# Altium schematic sheet DDR3_LoongSon.SchDoc
size A1
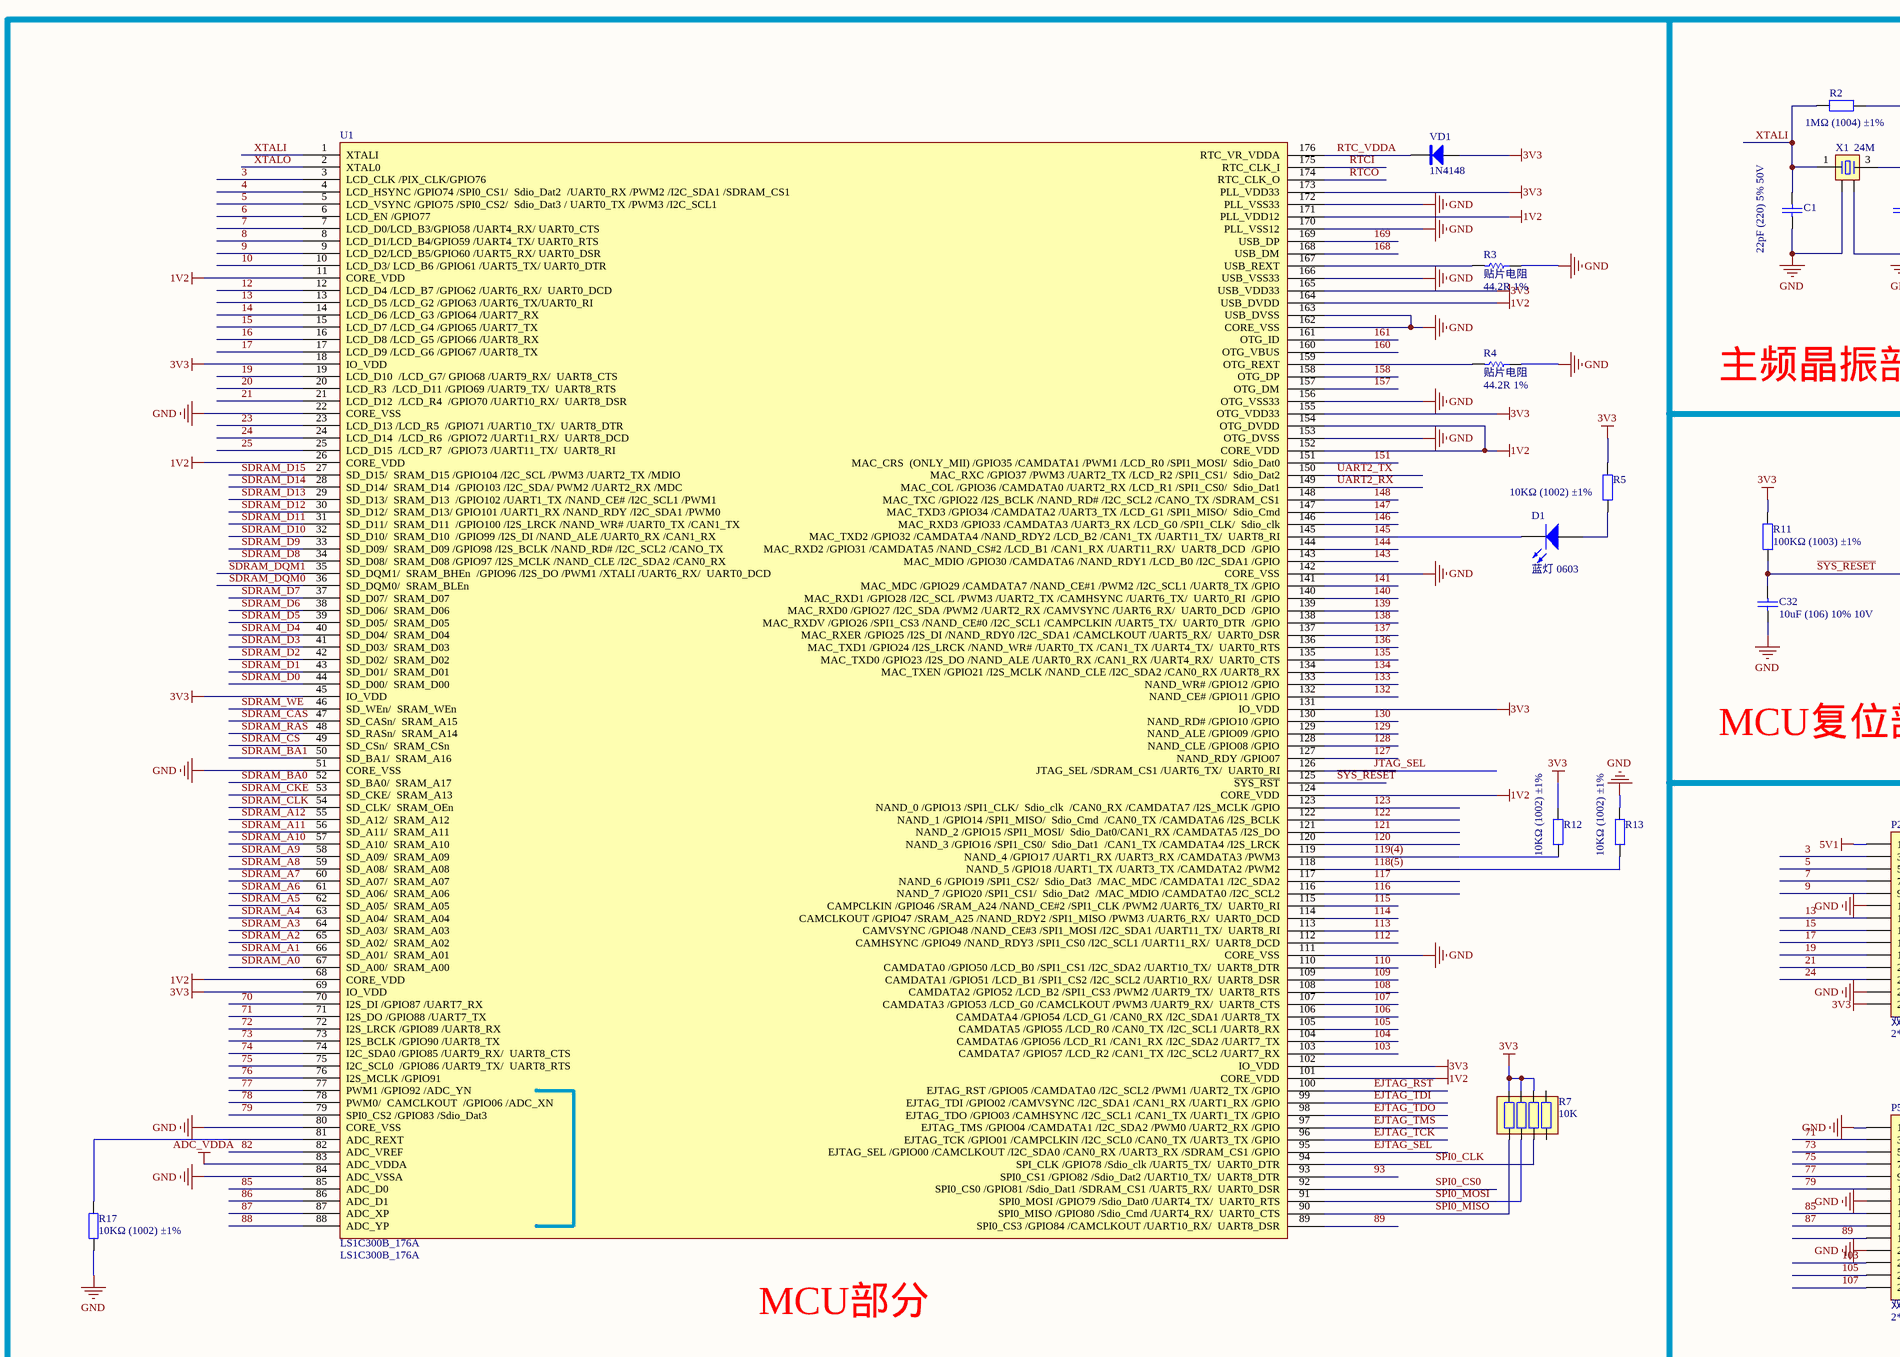
[diagram p0: DDR3_LoongSon.SchDoc, top left]
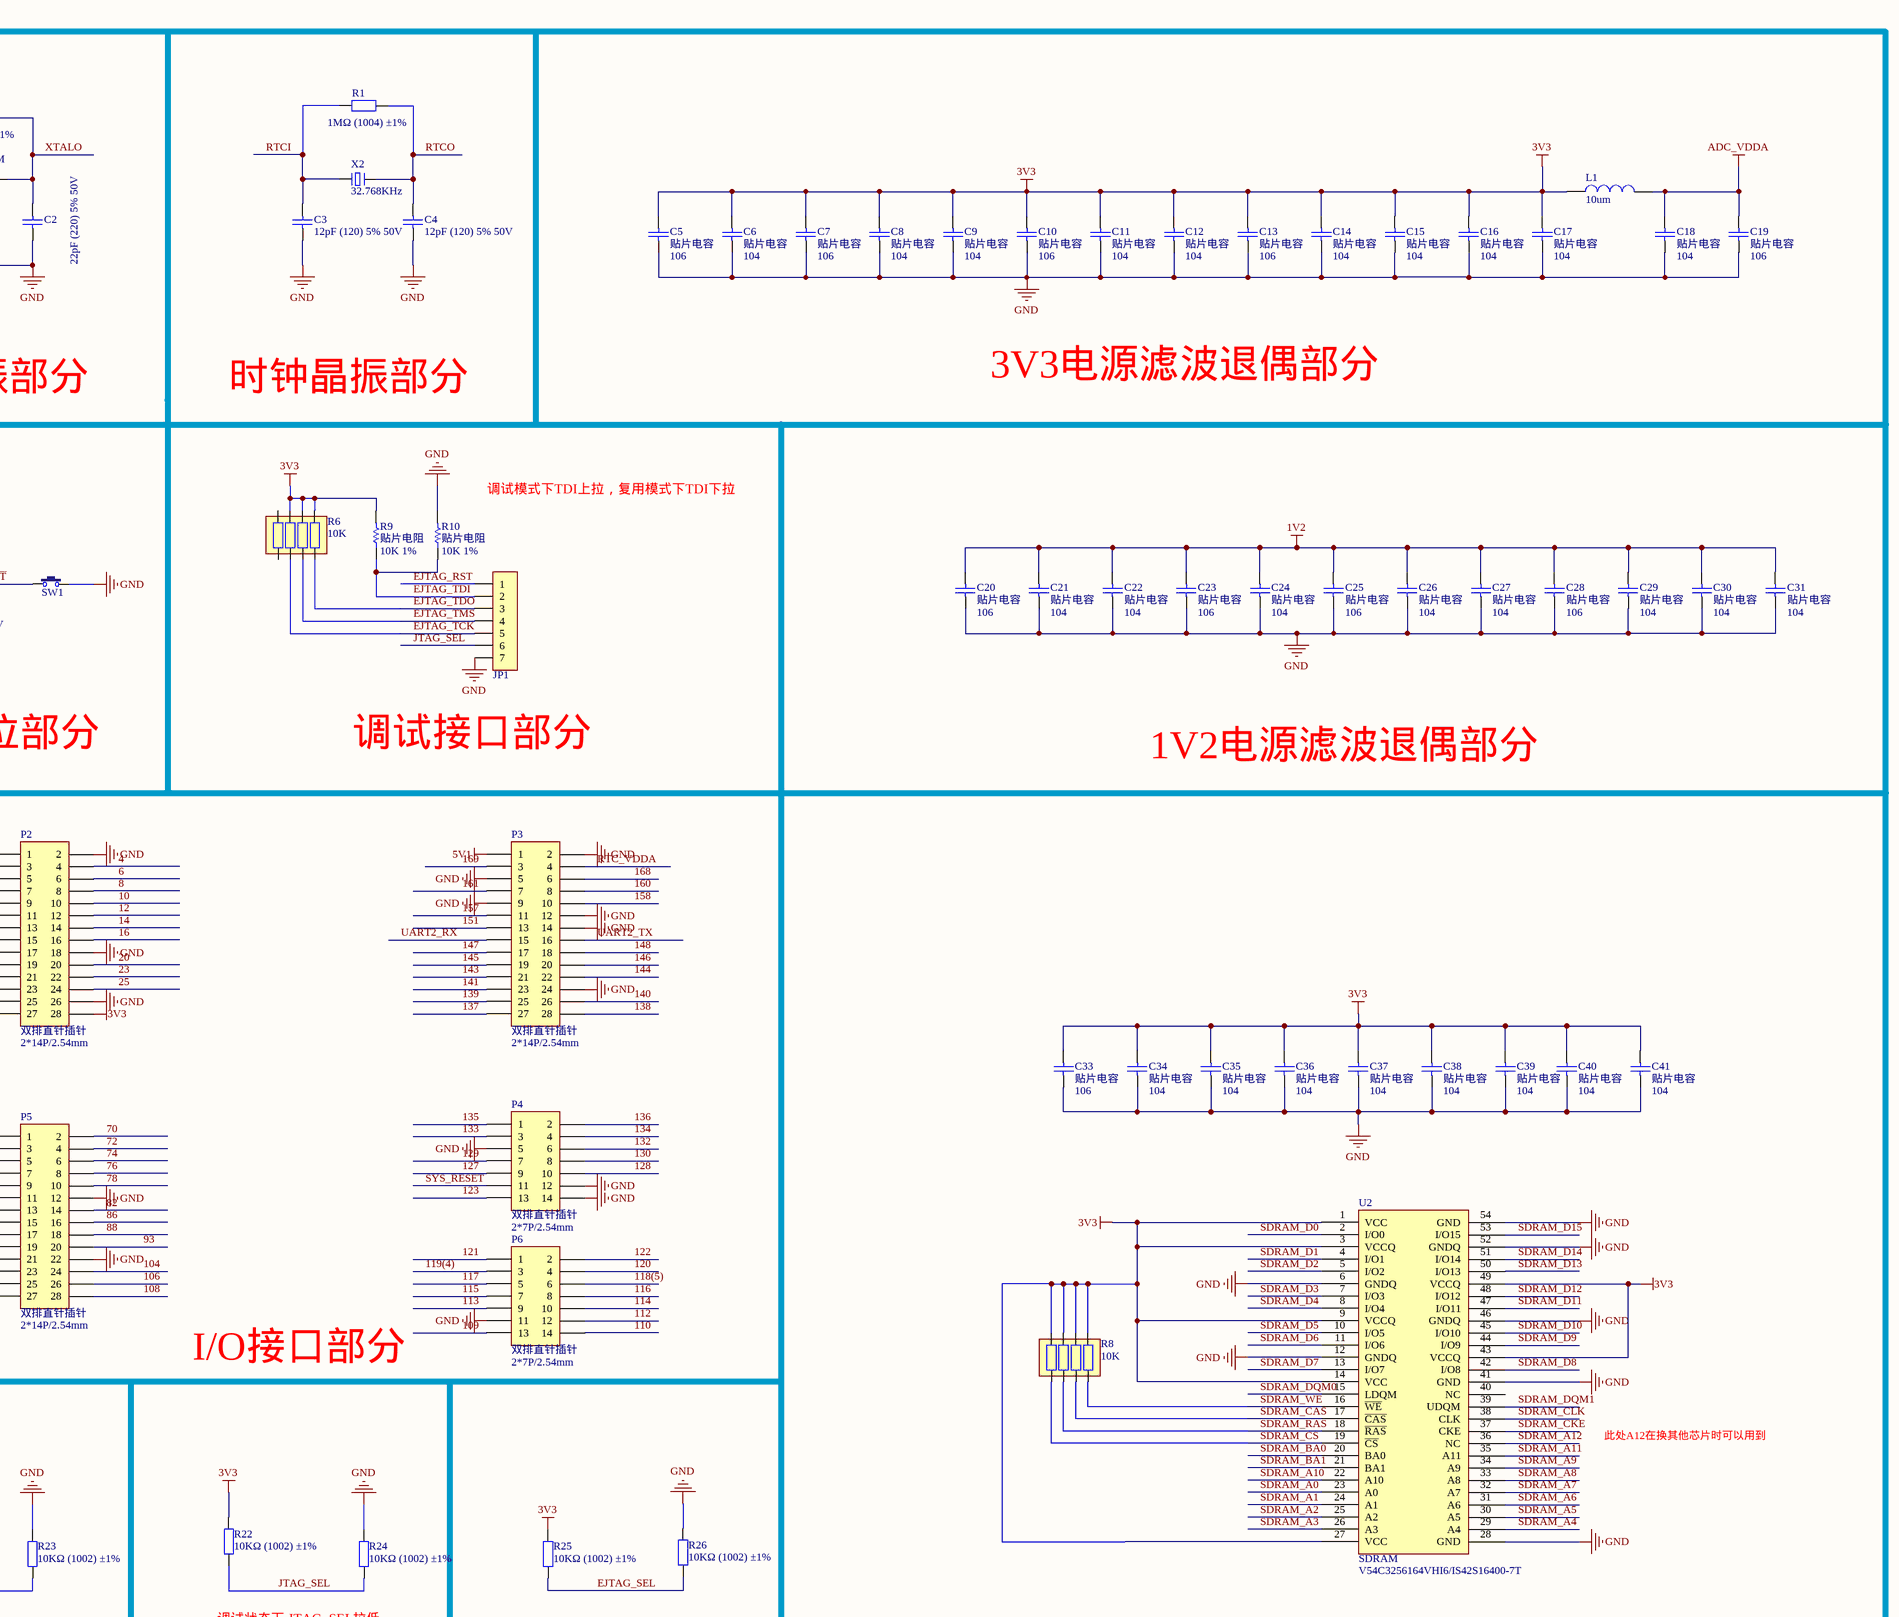
[diagram p1: DDR3_LoongSon.SchDoc, top right]
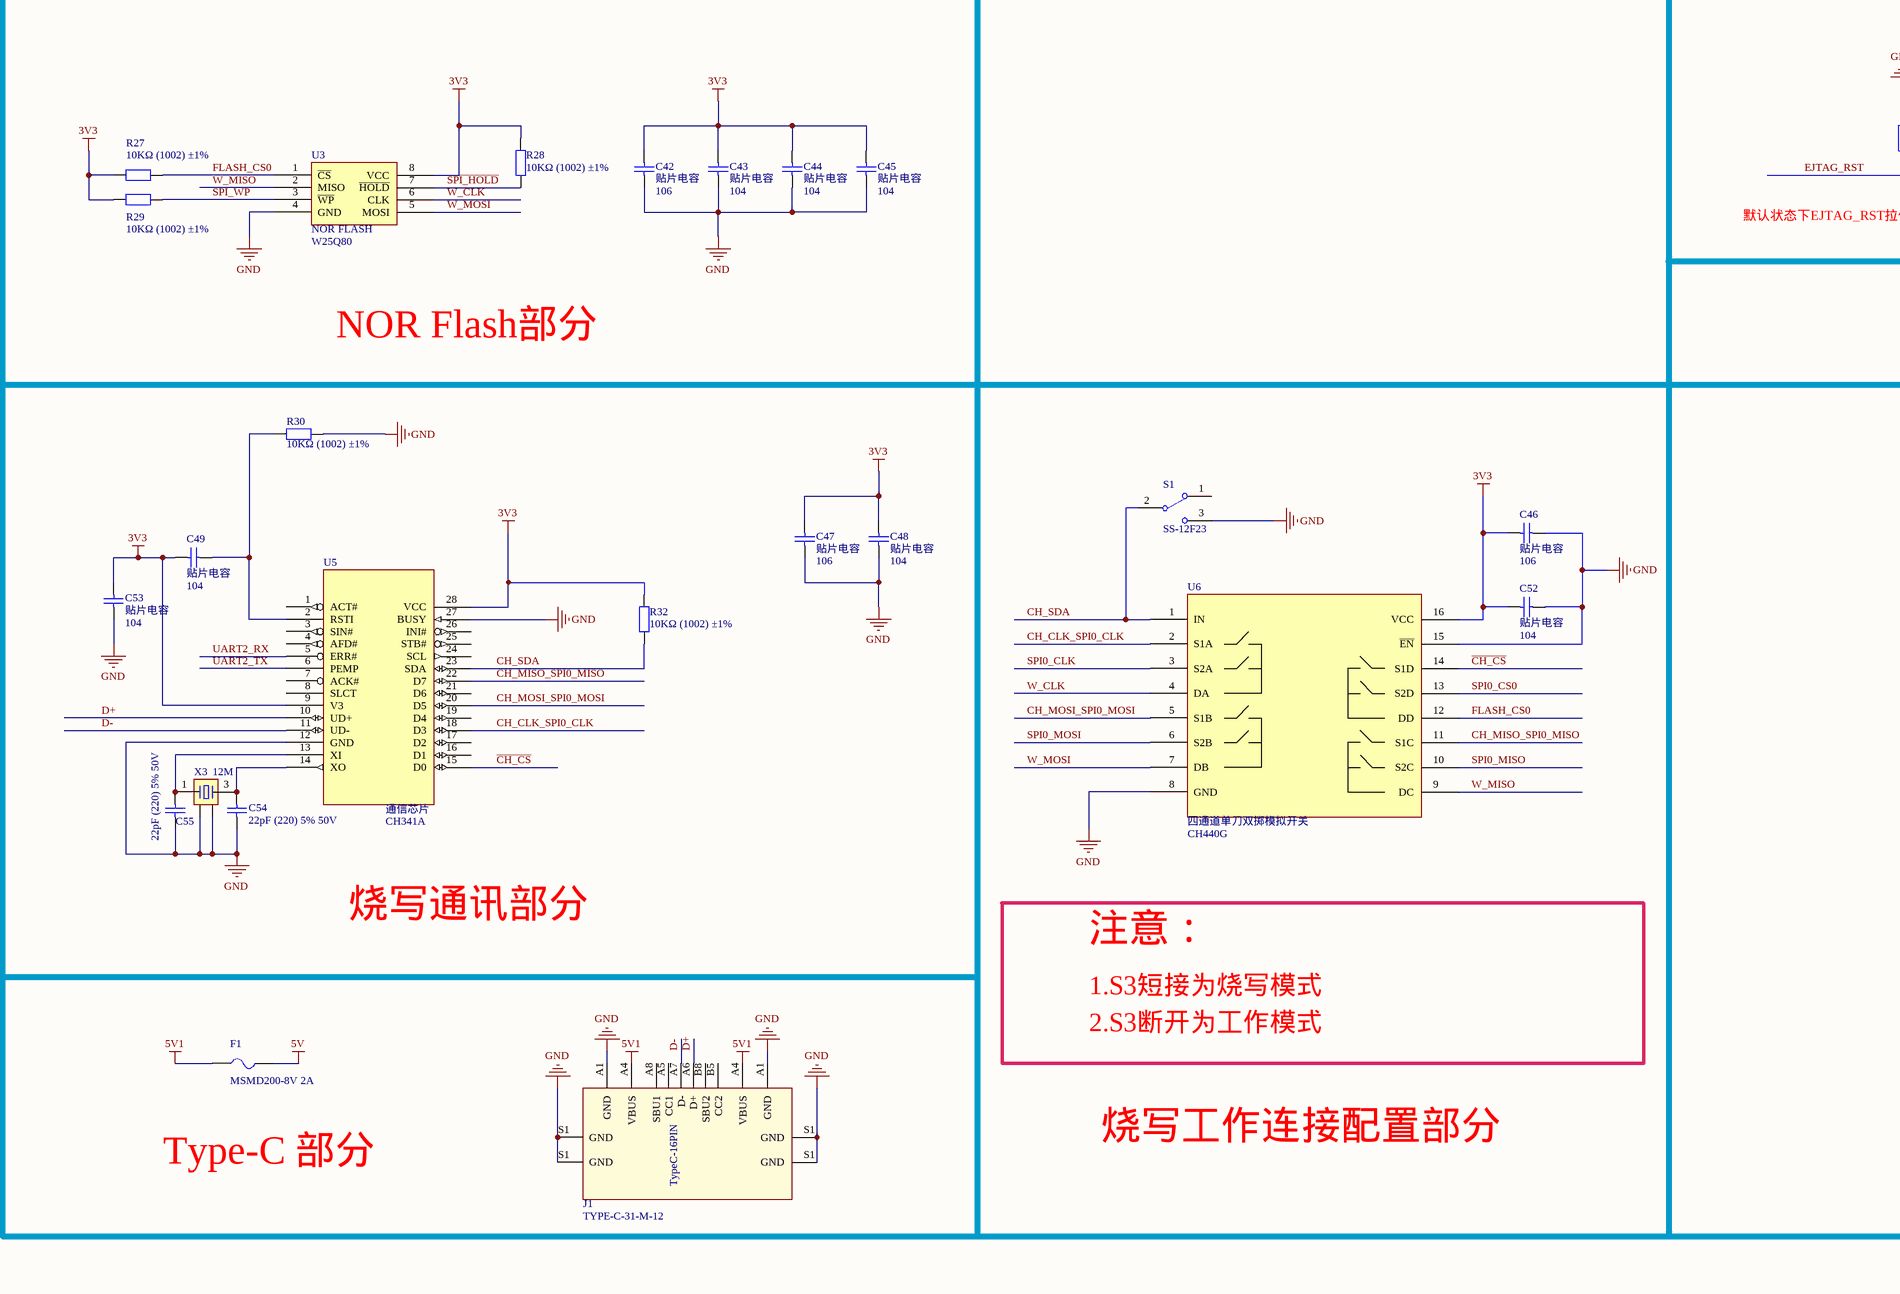
[diagram p2: DDR3_LoongSon.SchDoc, bottom left]
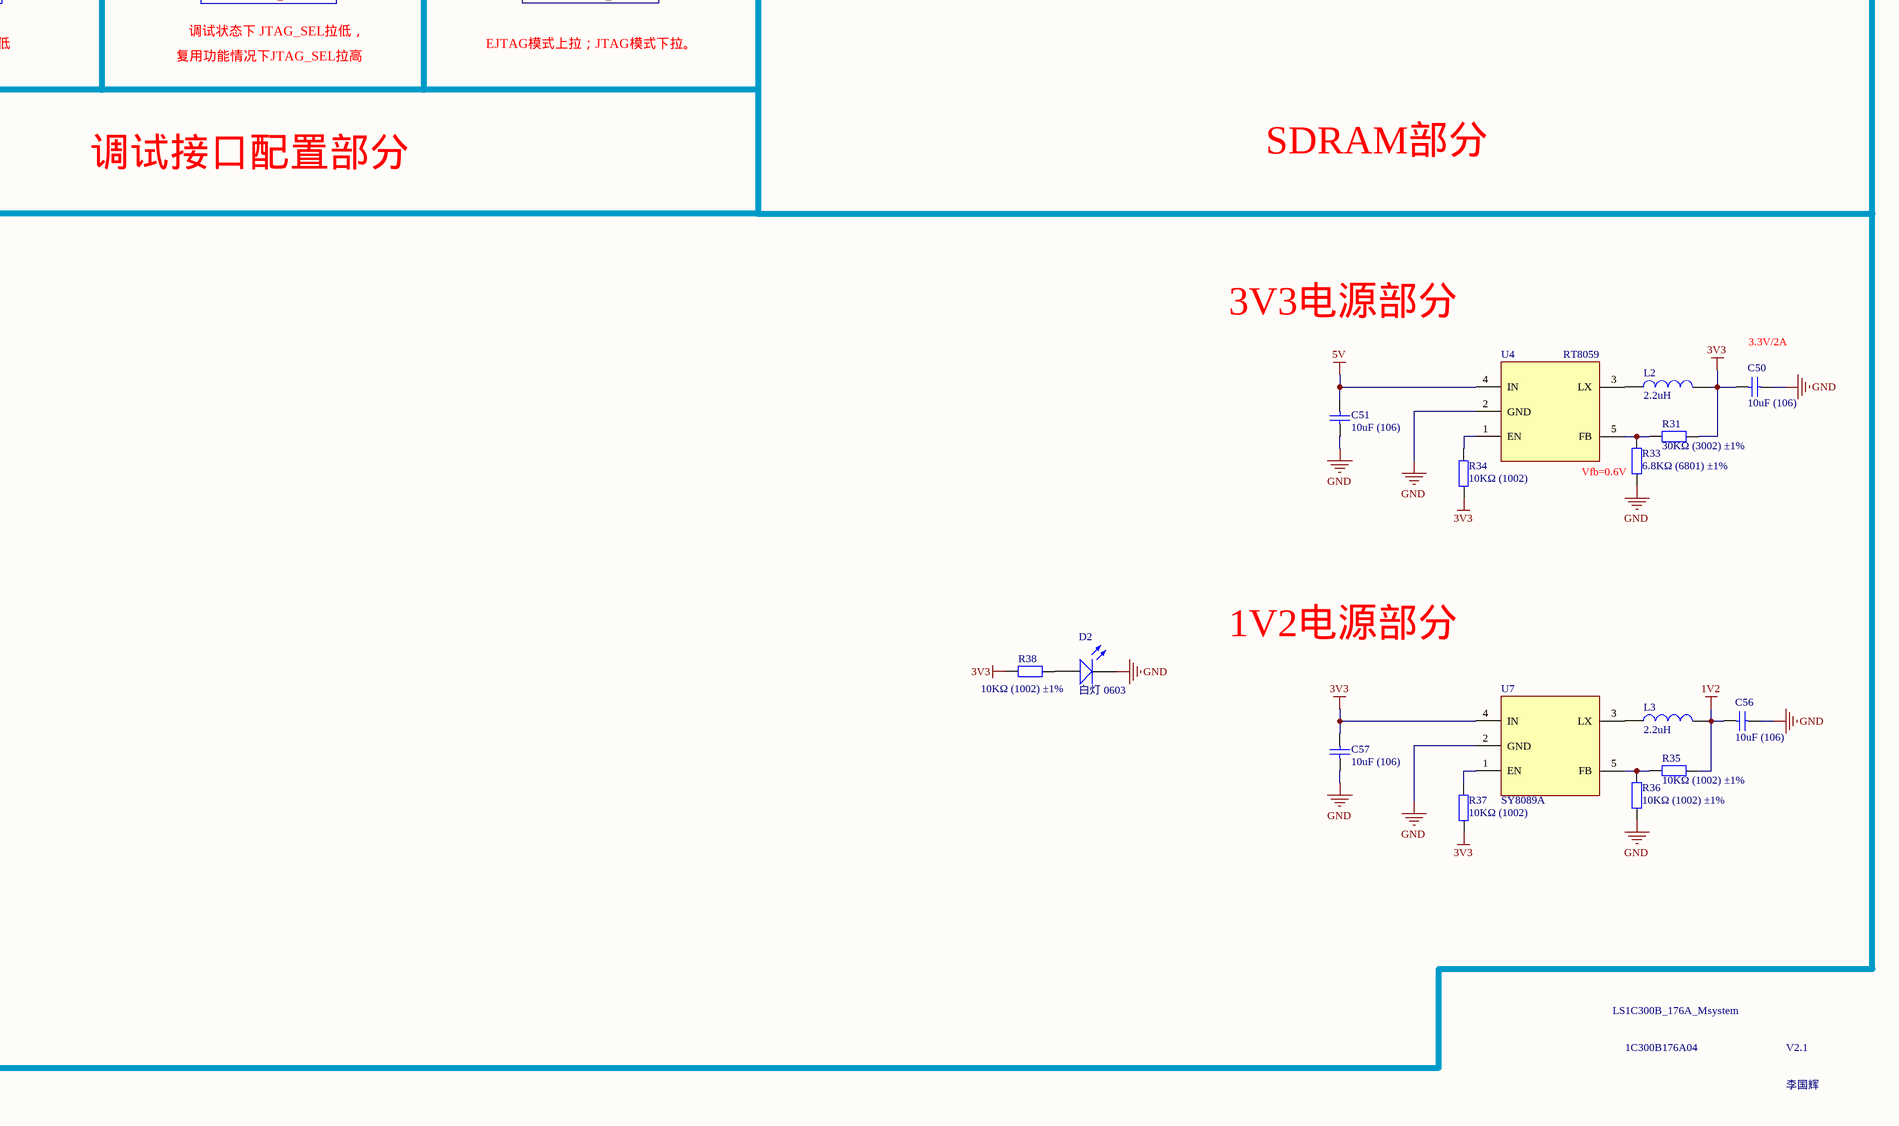
[diagram p3: DDR3_LoongSon.SchDoc, bottom right]

## Parts
C1  22pF (220) 5% 50V  [LC-0603_C]
C2  22pF (220) 5% 50V  [LC-0603_C]
C3  12pF (120) 5% 50V  [LC-0603_C]
C4  12pF (120) 5% 50V  [LC-0603_C]
C5  贴片电容  value 106  [LC-0603_C]
C6  贴片电容  value 104  [LC-0603_C]
C7  贴片电容  value 106  [LC-0603_C]
C8  贴片电容  value 104  [LC-0603_C]
C9  贴片电容  value 104  [LC-0603_C]
C10  贴片电容  value 106  [LC-0603_C]
C11  贴片电容  value 104  [LC-0603_C]
C12  贴片电容  value 104  [LC-0603_C]
C13  贴片电容  value 106  [LC-0603_C]
C14  贴片电容  value 104  [LC-0603_C]
C15  贴片电容  value 104  [LC-0603_C]
C16  贴片电容  value 104  [LC-0603_C]
C17  贴片电容  value 104  [LC-0603_C]
C18  贴片电容  value 104  [LC-0603_C]
C19  贴片电容  value 106  [LC-0603_C]
C20  贴片电容  value 106  [LC-0603_C]
C21  贴片电容  value 104  [LC-0603_C]
C22  贴片电容  value 104  [LC-0603_C]
C23  贴片电容  value 106  [LC-0603_C]
C24  贴片电容  value 104  [LC-0603_C]
C25  贴片电容  value 106  [LC-0603_C]
C26  贴片电容  value 104  [LC-0603_C]
C27  贴片电容  value 104  [LC-0603_C]
C28  贴片电容  value 106  [LC-0603_C]
C29  贴片电容  value 104  [LC-0603_C]
C30  贴片电容  value 104  [LC-0603_C]
C31  贴片电容  value 104  [LC-0603_C]
C32  10uF (106) 10% 10V  [LC-0603_C]
C33  贴片电容  value 106  [LC-0603_C]
C34  贴片电容  value 104  [LC-0603_C]
C35  贴片电容  value 104  [LC-0603_C]
C36  贴片电容  value 104  [LC-0603_C]
C37  贴片电容  value 104  [LC-0603_C]
C38  贴片电容  value 104  [LC-0603_C]
C39  贴片电容  value 104  [LC-0603_C]
C40  贴片电容  value 104  [LC-0603_C]
C41  贴片电容  value 104  [LC-0603_C]
C42  贴片电容  value 106  [LC-0603_C]
C43  贴片电容  value 104  [LC-0603_C]
C44  贴片电容  value 104  [LC-0603_C]
C45  贴片电容  value 104  [LC-0603_C]
C46  贴片电容  value 106  [LC-0603_C]
C47  贴片电容  value 106  [LC-0603_C]
C48  贴片电容  value 104  [LC-0603_C]
C49  贴片电容  value 104  [LC-0603_C]
C50  10uF (106)  [LC-0603_C]
C51  10uF (106)  [LC-0603_C]
C52  贴片电容  value 104  [LC-0603_C]
C53  贴片电容  value 104  [LC-0603_C]
C54  22pF (220) 5% 50V  [LC-0603_C]
C55  22pF (220) 5% 50V  [LC-0603_C]
C56  10uF (106)  [LC-0603_C]
C57  10uF (106)  [LC-0603_C]
D1  蓝灯 0603  [LC-0603_LED_S1]
D2  白灯 0603  [LC-0603_LED_S1]
F1  MSMD200-8V 2A  [FU 1206]
J1  TYPE-C-31-M-12  [TYPE-C-31-M-12]
JP1  HDR-1X7  [HDR-1X7]  (value not drawn)
L1  10um  [L 0603]
L2  2.2uH  [2520-L]
L3  2.2uH  [2520-L]
P2  双排直针插针  value 2*14P/2.54mm  [HDR2X14]
P3  双排直针插针  value 2*14P/2.54mm  [HDR2X14]
P4  双排直针插针  value 2*7P/2.54mm  [HDR2X7]
P5  双排直针插针  value 2*14P/2.54mm  [HDR2X14]
P6  双排直针插针  value 2*7P/2.54mm  [HDR2X7]
R1  1MΩ (1004) ±1%  [LC-0603_R]
R2  1MΩ (1004) ±1%  [LC-0603_R]
R3  贴片电阻  value 44.2R 1%  [LC-0603_R]
R4  贴片电阻  value 44.2R 1%  [LC-0603_R]
R5  10KΩ (1002) ±1%  [LC-0603_R]
R6  10K  [RCA-8P4R-0603]
R7  10K  [RCA-8P4R-0603]
R8  10K  [RCA-8P4R-0603]
R9  贴片电阻  value 10K 1%  [LC-0603_R]
R10  贴片电阻  value 10K 1%  [LC-0603_R]
R11  100KΩ (1003) ±1%  [LC-0603_R]
R12  10KΩ (1002) ±1%  [LC-0603_R]
R13  10KΩ (1002) ±1%  [LC-0603_R]
R17  10KΩ (1002) ±1%  [LC-0603_R]
R22  10KΩ (1002) ±1%  [LC-0603_R]
R23  10KΩ (1002) ±1%  [LC-0603_R]
R24  10KΩ (1002) ±1%  [LC-0603_R]
R25  10KΩ (1002) ±1%  [LC-0603_R]
R26  10KΩ (1002) ±1%  [LC-0603_R]
R27  10KΩ (1002) ±1%  [LC-0603_R]
R28  10KΩ (1002) ±1%  [LC-0603_R]
R29  10KΩ (1002) ±1%  [LC-0603_R]
R30  10KΩ (1002) ±1%  [LC-0603_R]
R31  30KΩ (3002) ±1%  [LC-0603_R]
R32  10KΩ (1002) ±1%  [LC-0603_R]
R33  6.8KΩ (6801) ±1%  [LC-0603_R]
R34  10KΩ (1002)  [LC-0603_R]
R35  10KΩ (1002) ±1%  [LC-0603_R]
R36  10KΩ (1002) ±1%  [LC-0603_R]
R37  10KΩ (1002)  [LC-0603_R]
R38  10KΩ (1002) ±1%  [LC-0603_R]
S1  SS-12F23  [MSK-12C01-07]
SW1  3x6x5  [TSW SMD-3*6*2.5]  (value not drawn)
U1  LS1C300B_176A  [QFP176]
U2  SDRAM  value V54C3256164VHI6/IS42S16400-7T  [TSOP54]
U3  NOR FLASH  value W25Q80  [SOIC-8-N]
U4  RT8059  [SOT23-5N]
U5  通信芯片  value CH341A  [SOP28]
U6  四通道单刀双掷模拟开关  value CH440G  [SOP-16]
U7  SY8089A  [SOT23-5N]
VD1  1N4148  [MINI_MELF (LL34)]
X1  24M  [XTAL-3225]
X2  32.768KHz  [XTAL-3215]
X3  12M  [XTAL-3225]

## Nets
1V2: C20.2 C21.2 C22.2 C23.2 C24.2 C25.2 C26.2 C27.2 C28.2 C29.2 C30.2 C31.2 C56.1 L3.2 R35.2 U1.11(CORE_VDD) U1.26(CORE_VDD) U1.68(CORE_VDD) U1.101(CORE_VDD) U1.124(CORE_VDD) U1.152(CORE_VDD) U1.154(OTG_DVDD) U1.164(USB_DVDD) U1.171(PLL_VDD12)
3V3: C5.2 C6.2 C7.2 C8.2 C9.2 C10.2 C11.2 C12.2 C13.2 C14.2 C15.2 C16.2 C17.2 C33.2 C34.2 C35.2 C36.2 C37.2 C38.2 C39.2 C40.2 C41.2 C42.2 C43.2 C44.2 C45.2 C46.2 C47.2 C48.2 C49.2 C50.1 C52.2 C53.2 C57.2 L1.1 L2.2 P2.27 P2.28 R5.2 R6.5 R6.6 R6.7 R7.6 R7.7 R7.8 R8.5 R8.6 R8.7 R8.8 R9.2 R11.2 R12.2 R22.2 R25.2 R27.1 R28.2 R29.1 R31.2 R32.2 R34.1 R37.1 R38.1 U1.18(IO_VDD) U1.45(IO_VDD) U1.69(IO_VDD) U1.102(IO_VDD) U1.131(IO_VDD) U1.155(OTG_VDD33) U1.165(USB_VDD33) U1.173(PLL_VDD33) U2.1(VCC) U2.3(VCCQ) U2.9(VCCQ) U2.14(VCC) U2.27(VCC) U2.43(VCCQ) U2.49(VCCQ) U3.8(VCC) U5.9(V3) U5.28(VCC) U6.16(VCC) U7.4(IN) VD1.1(A)
5V: C51.2 F1.2 U4.4(IN)
5V1: F1.1 J1.A4(VBUS) P2.1 P3.1
ADC_VDDA: C18.2 C19.2 L1.2 U1.83(ADC_VDDA)
GND: C1.1 C2.1 C3.1 C4.1 C5.1 C6.1 C7.1 C8.1 C9.1 C10.1 C11.1 C12.1 C13.1 C14.1 C15.1 C16.1 C17.1 C18.1 C19.1 C20.1 C21.1 C22.1 C23.1 C24.1 C25.1 C26.1 C27.1 C28.1 C29.1 C30.1 C31.1 C32.1 C33.1 C34.1 C35.1 C36.1 C37.1 C38.1 C39.1 C40.1 C41.1 C42.1 C43.1 C44.1 C45.1 C46.1 C47.1 C48.1 C50.2 C51.1 C52.1 C53.1 C54.1 C55.1 C56.2 C57.1 D2.K J1.A1(GND) J1.S1(GND) JP1.7 P2.2 P2.11 P2.18 P2.25 P2.26 P3.2 P3.5 P3.9 P3.12 P3.14 P3.24 P4.5 P4.12 P4.14 P5.1 P5.12 P5.13 P5.21 P5.22 P6.11 R3.1 R4.1 R10.2 R13.2 R17.1 R23.2 R24.2 R26.2 R30.2 R33.1 R36.1 S1.3 SW1.2 U1.22(CORE_VSS) U1.51(CORE_VSS) U1.80(CORE_VSS) U1.84(ADC_VSSA) U1.111(CORE_VSS) U1.142(CORE_VSS) U1.153(OTG_DVSS) U1.156(OTG_VSS33) U1.162(CORE_VSS) U1.163(USB_DVSS) U1.166(USB_VSS33) U1.170(PLL_VSS12) U1.172(PLL_VSS33) U2.6(GNDQ) U2.12(GNDQ) U2.28(GND) U2.41(GND) U2.46(GNDQ) U2.52(GNDQ) U2.54(GND) U3.4(GND) U4.2(GND) U5.12(GND) U5.27(BUSY) U6.8(GND) U6.15(~{EN}) U7.2(GND) X1.2 X1.4 X3.2 X3.4
3: P2.3 U1.3(LCD_CLK_/PIX_CLK/GPIO76)
4: P2.4 U1.4(LCD_HSYNC_/GPIO74_/SPI0_CS1/__Sdio_Dat2__/UART0_RX_/PWM2_/I2C_SDA1_/SDRAM_CS1)
5: P2.5 U1.5(LCD_VSYNC_/GPIO75_/SPI0_CS2/__Sdio_Dat3_/_UART0_TX_/PWM3_/I2C_SCL1)
6: P2.6 U1.6(LCD_EN_/GPIO77)
7: P2.7 U1.7(LCD_D0/LCD_B3/GPIO58_/UART4_RX/_UART0_CTS)
8: P2.8 U1.8(LCD_D1/LCD_B4/GPIO59_/UART4_TX/_UART0_RTS)
9: P2.9 U1.9(LCD_D2/LCD_B5/GPIO60_/UART5_RX/_UART0_DSR)
10: P2.10 U1.10(LCD_D3/_LCD_B6_/GPIO61_/UART5_TX/_UART0_DTR)
12: P2.12 U1.12(LCD_D4_/LCD_B7_/GPIO62_/UART6_RX/__UART0_DCD)
13: P2.13 U1.13(LCD_D5_/LCD_G2_/GPIO63_/UART6_TX/UART0_RI)
14: P2.14 U1.14(LCD_D6_/LCD_G3_/GPIO64_/UART7_RX)
15: P2.15 U1.15(LCD_D7_/LCD_G4_/GPIO65_/UART7_TX)
16: P2.16 U1.16(LCD_D8_/LCD_G5_/GPIO66_/UART8_RX)
17: P2.17 U1.17(LCD_D9_/LCD_G6_/GPIO67_/UART8_TX)
19: P2.19 U1.19(LCD_D10__/LCD_G7/_GPIO68_/UART9_RX/__UART8_CTS)
20: P2.20 U1.20(LCD_R3__/LCD_D11_/GPIO69_/UART9_TX/__UART8_RTS)
21: P2.21 U1.21(LCD_D12__/LCD_R4__/GPIO70_/UART10_RX/__UART8_DSR)
23: P2.22 U1.23(LCD_D13_/LCD_R5__/GPIO71_/UART10_TX/__UART8_DTR)
24: P2.23 U1.24(LCD_D14__/LCD_R6__/GPIO72_/UART11_RX/__UART8_DCD)
25: P2.24 U1.25(LCD_D15__/LCD_R7__/GPIO73_/UART11_TX/__UART8_RI)
70: P5.2 U1.70(I2S_DI_/GPIO87_/UART7_RX)
71: P5.3 U1.71(I2S_DO_/GPIO88_/UART7_TX)
72: P5.4 U1.72(I2S_LRCK_/GPIO89_/UART8_RX)
73: P5.5 U1.73(I2S_BCLK_/GPIO90_/UART8_TX)
74: P5.6 U1.74(I2C_SDA0_/GPIO85_/UART9_RX/__UART8_CTS)
75: P5.7 U1.75(I2C_SCL0__/GPIO86_/UART9_TX/__UART8_RTS)
76: P5.8 U1.76(I2S_MCLK_/GPIO91)
77: P5.9 U1.77(PWM1_/GPIO92_/ADC_YN)
78: P5.10 U1.78(PWM0/__CAMCLKOUT__/GPIO06_/ADC_XN)
79: P5.11 U1.79(SPI0_CS2_/GPIO83_/Sdio_Dat3)
82: P5.14 U1.82(ADC_VREF)
85: P5.15 U1.85(ADC_D0)
86: P5.16 U1.86(ADC_D1)
87: P5.17 U1.87(ADC_XP)
88: P5.18 U1.88(ADC_YP)
89: P5.19 U1.89(SPI0_CS3_/GPIO84_/CAMCLKOUT_/UART10_RX/__UART8_DSR)
93: P5.20 U1.93(SPI0_CS1_/GPIO82_/Sdio_Dat2_/UART10_TX/__UART8_DTR)
103: P5.23 U1.103(CAMDATA7_/GPIO57_/LCD_R2_/CAN1_TX_/I2C_SCL2_/UART7_RX)
104: P5.24 U1.104(CAMDATA6_/GPIO56_/LCD_R1_/CAN1_RX_/I2C_SDA2_/UART7_TX)
105: P5.25 U1.105(CAMDATA5_/GPIO55_/LCD_R0_/CAN0_TX_/I2C_SCL1_/UART8_RX)
106: P5.26 U1.106(CAMDATA4_/GPIO54_/LCD_G1_/CAN0_RX_/I2C_SDA1_/UART8_TX)
107: P5.27 U1.107(CAMDATA3_/GPIO53_/LCD_G0_/CAMCLKOUT_/PWM3_/UART9_RX/__UART8_CTS)
108: P5.28 U1.108(CAMDATA2_/GPIO52_/LCD_B2_/SPI1_CS3_/PWM2_/UART9_TX/__UART8_RTS)
109: P6.13 U1.109(CAMDATA1_/GPIO51_/LCD_B1_/SPI1_CS2_/I2C_SCL2_/UART10_RX/__UART8_DSR)
110: P6.14 U1.110(CAMDATA0_/GPIO50_/LCD_B0_/SPI1_CS1_/I2C_SDA2_/UART10_TX/__UART8_DTR)
112: P6.12 U1.112(CAMHSYNC_/GPIO49_/NAND_RDY3_/SPI1_CS0_/I2C_SCL1_/UART11_RX/__UART8_DCD)
113: P6.9 U1.113(CAMVSYNC_/GPIO48_/NAND_CE#3_/SPI1_MOSI_/I2C_SDA1_/UART11_TX/__UART8_RI)
114: P6.10 U1.114(CAMCLKOUT_/GPIO47_/SRAM_A25_/NAND_RDY2_/SPI1_MISO_/PWM3_/UART6_RX/__UART0_DCD)
115: P6.7 U1.115(CAMPCLKIN_/GPIO46_/SRAM_A24_/NAND_CE#2_/SPI1_CLK_/PWM2_/UART6_TX/__UART0_RI)
116: P6.8 U1.116(NAND_7_/GPIO20_/SPI1_CS1/__Sdio_Dat2__/MAC_MDIO_/CAMDATA0_/I2C_SCL2)
117: P6.5 U1.117(NAND_6_/GPIO19_/SPI1_CS2/__Sdio_Dat3__/MAC_MDC_/CAMDATA1_/I2C_SDA2)
118(5): P6.6 R13.1 U1.118(NAND_5_/GPIO18_/UART1_TX_/UART3_TX_/CAMDATA2_/PWM2)
119(4): P6.3 R12.1 U1.119(NAND_4_/GPIO17_/UART1_RX_/UART3_RX_/CAMDATA3_/PWM3)
120: P6.4 U1.120(NAND_3_/GPIO16_/SPI1_CS0/__Sdio_Dat1__/CAN1_TX_/CAMDATA4_/I2S_LRCK)
121: P6.1 U1.121(NAND_2_/GPIO15_/SPI1_MOSI/__Sdio_Dat0/CAN1_RX_/CAMDATA5_/I2S_DO)
122: P6.2 U1.122(NAND_1_/GPIO14_/SPI1_MISO/__Sdio_Cmd__/CAN0_TX_/CAMDATA6_/I2S_BCLK)
123: P4.13 U1.123(NAND_0_/GPIO13_/SPI1_CLK/__Sdio_clk__/CAN0_RX_/CAMDATA7_/I2S_MCLK_/GPIO)
127: P4.9 U1.127(NAND_RDY_/GPIO07)
128: P4.10 U1.128(NAND_CLE_/GPIO08_/GPIO)
129: P4.7 U1.129(NAND_ALE_/GPIO09_/GPIO)
130: P4.8 U1.130(NAND_RD#_/GPIO10_/GPIO)
132: P4.6 U1.132(NAND_CE#_/GPIO11_/GPIO)
133: P4.3 U1.133(NAND_WR#_/GPIO12_/GPIO)
134: P4.4 U1.134(MAC_TXEN_/GPIO21_/I2S_MCLK_/NAND_CLE_/I2C_SDA2_/CAN0_RX_/UART8_RX)
135: P4.1 U1.135(MAC_TXD0_/GPIO23_/I2S_DO_/NAND_ALE_/UART0_RX_/CAN1_RX_/UART4_RX/__UART0_CTS)
136: P4.2 U1.136(MAC_TXD1_/GPIO24_/I2S_LRCK_/NAND_WR#_/UART0_TX_/CAN1_TX_/UART4_TX/__UART0_RTS)
137: P3.27 U1.137(MAC_RXER_/GPIO25_/I2S_DI_/NAND_RDY0_/I2C_SDA1_/CAMCLKOUT_/UART5_RX/__UART0_DSR)
138: P3.28 U1.138(MAC_RXDV_/GPIO26_/SPI1_CS3_/NAND_CE#0_/I2C_SCL1_/CAMPCLKIN_/UART5_TX/__UART0_DTR__/GPIO)
139: P3.25 U1.139(MAC_RXD0_/GPIO27_/I2C_SDA_/PWM2_/UART2_RX_/CAMVSYNC_/UART6_RX/__UART0_DCD__/GPIO)
140: P3.26 U1.140(MAC_RXD1_/GPIO28_/I2C_SCL_/PWM3_/UART2_TX_/CAMHSYNC_/UART6_TX/__UART0_RI__/GPIO)
141: P3.23 U1.141(MAC_MDC_/GPIO29_/CAMDATA7_/NAND_CE#1_/PWM2_/I2C_SCL1_/UART8_TX_/GPIO)
143: P3.21 U1.143(MAC_MDIO_/GPIO30_/CAMDATA6_/NAND_RDY1_/LCD_B0_/I2C_SDA1_/GPIO)
144: P3.22 U1.144(MAC_RXD2_/GPIO31_/CAMDATA5_/NAND_CS#2_/LCD_B1_/CAN1_RX_/UART11_RX/__UART8_DCD__/GPIO)
145: D1.K P3.19 U1.145(MAC_TXD2_/GPIO32_/CAMDATA4_/NAND_RDY2_/LCD_B2_/CAN1_TX_/UART11_TX/__UART8_RI)
146: P3.20 U1.146(MAC_RXD3_/GPIO33_/CAMDATA3_/UART3_RX_/LCD_G0_/SPI1_CLK/__Sdio_clk)
147: P3.17 U1.147(MAC_TXD3_/GPIO34_/CAMDATA2_/UART3_TX_/LCD_G1_/SPI1_MISO/__Sdio_Cmd)
148: P3.18 U1.148(MAC_TXC_/GPIO22_/I2S_BCLK_/NAND_RD#_/I2C_SCL2_/CANO_TX_/SDRAM_CS1)
151: P3.13 U1.151(MAC_CRS__(ONLY_MII)_/GPIO35_/CAMDATA1_/PWM1_/LCD_R0_/SPI1_MOSI/__Sdio_Dat0)
157: P3.11 U1.157(OTG_DM)
158: P3.10 U1.158(OTG_DP)
160: P3.8 U1.160(OTG_VBUS)
161: P3.7 U1.161(OTG_ID)
168: P3.6 U1.168(USB_DM)
169: P3.3 U1.169(USB_DP)
~{CH_CS}: U5.15(D0) U6.14(S1D)
CH_CLK_SPI0_CLK: U5.18(D3) U6.2(S1A)
CH_MISO_SPI0_MISO: U5.22(D7) U6.11(S1C)
CH_MOSI_SPI0_MOSI: U5.20(D5) U6.5(S1B)
CH_SDA: R32.1 S1.2 U5.23(SDA) U6.1(IN)
D+: J1.A6(D+) U5.10(UD+)
D-: J1.A7(D-) U5.11(UD-)
EJTAG_RST: JP1.1 R23.1 U1.100(EJTAG_RST_/GPIO05_/CAMDATA0_/I2C_SCL2_/PWM1_/UART2_TX_/GPIO)
EJTAG_SEL: R25.1 R26.1 U1.95(EJTAG_SEL_/GPIO00_/CAMCLKOUT_/I2C_SDA0_/CAN0_RX_/UART3_RX_/SDRAM_CS1_/GPIO)
EJTAG_TCK: JP1.5 R6.2 U1.96(EJTAG_TCK_/GPIO01_/CAMPCLKIN_/I2C_SCL0_/CAN0_TX_/UART3_TX_/GPIO)
EJTAG_TDI: JP1.2 R9.1 R10.1 U1.99(EJTAG_TDI_/GPIO02_/CAMVSYNC_/I2C_SDA1_/CAN1_RX_/UART1_RX_/GPIO)
EJTAG_TDO: JP1.3 R6.4 U1.98(EJTAG_TDO_/GPIO03_/CAMHSYNC_/I2C_SCL1_/CAN1_TX_/UART1_TX_/GPIO)
EJTAG_TMS: JP1.4 R6.3 U1.97(EJTAG_TMS_/GPIO04_/CAMDATA1_/I2C_SDA2_/PWM0_/UART2_RX_/GPIO)
FLASH_CS0: R27.2 U3.1(~{CS}) U6.12(DD)
JTAG_SEL: JP1.6 R22.1 R24.1 U1.126(JTAG_SEL_/SDRAM_CS1_/UART6_TX/__UART0_RI)
RTC_VDDA: P3.4 U1.176(RTC_VR_VDDA) VD1.2(K)
RTCI: C3.2 R1.1 U1.175(RTC_CLK_I) X2.1
RTCO: C4.2 R1.2 U1.174(RTC_CLK_O) X2.2
~{SDRAM_CAS}: R8.3 U1.47(SD_CASn/__SRAM_A15) U2.17(~{CAS})
~{SDRAM_CS}: R8.1 U1.49(SD_CSn/__SRAM_CSn) U2.19(~{CS})
~{SDRAM_RAS}: R8.2 U1.48(SD_RASn/__SRAM_A14) U2.18(~{RAS})
~{SDRAM_WE}: R8.4 U1.46(SD_WEn/__SRAM_WEn) U2.16(~{WE})
~{SPI_HOLD}: R28.1 U3.7(~{HOLD})
~{SPI_WP}: R29.2 U3.3(~{WP})
~{SYS_RESET}: C32.2 P4.11 R11.1 SW1.1 U1.125(~{SYS_RST})
SDRAM_A0: U1.67(SD_A00/__SRAM_A00) U2.23(A0)
SDRAM_A1: U1.66(SD_A01/__SRAM_A01) U2.24(A1)
SDRAM_A2: U1.65(SD_A02/__SRAM_A02) U2.25(A2)
SDRAM_A3: U1.64(SD_A03/__SRAM_A03) U2.26(A3)
SDRAM_A4: U1.63(SD_A04/__SRAM_A04) U2.29(A4)
SDRAM_A5: U1.62(SD_A05/__SRAM_A05) U2.30(A5)
SDRAM_A6: U1.61(SD_A06/__SRAM_A06) U2.31(A6)
SDRAM_A7: U1.60(SD_A07/__SRAM_A07) U2.32(A7)
SDRAM_A8: U1.59(SD_A08/__SRAM_A08) U2.33(A8)
SDRAM_A9: U1.58(SD_A09/__SRAM_A09) U2.34(A9)
SDRAM_A10: U1.57(SD_A10/__SRAM_A10) U2.22(A10)
SDRAM_A11: U1.56(SD_A11/__SRAM_A11) U2.35(A11)
SDRAM_A12: U1.55(SD_A12/__SRAM_A12) U2.36(NC)
SDRAM_BA0: U1.52(SD_BA0/__SRAM_A17) U2.20(BA0)
SDRAM_BA1: U1.50(SD_BA1/__SRAM_A16) U2.21(BA1)
SDRAM_CKE: U1.53(SD_CKE/__SRAM_A13) U2.37(CKE)
SDRAM_CLK: U1.54(SD_CLK/__SRAM_OEn) U2.38(CLK)
SDRAM_D0: U1.44(SD_D00/__SRAM_D00) U2.2(I/O0)
SDRAM_D1: U1.43(SD_D01/__SRAM_D01) U2.4(I/O1)
SDRAM_D2: U1.42(SD_D02/__SRAM_D02) U2.5(I/O2)
SDRAM_D3: U1.41(SD_D03/__SRAM_D03) U2.7(I/O3)
SDRAM_D4: U1.40(SD_D04/__SRAM_D04) U2.8(I/O4)
SDRAM_D5: U1.39(SD_D05/__SRAM_D05) U2.10(I/O5)
SDRAM_D6: U1.38(SD_D06/__SRAM_D06) U2.11(I/O6)
SDRAM_D7: U1.37(SD_D07/__SRAM_D07) U2.13(I/O7)
SDRAM_D8: U1.34(SD_D08/__SRAM_D08_/GPIO97_/I2S_MCLK_/NAND_CLE_/I2C_SDA2_/CAN0_RX) U2.42(I/O8)
SDRAM_D9: U1.33(SD_D09/__SRAM_D09_/GPIO98_/I2S_BCLK_/NAND_RD#_/I2C_SCL2_/CANO_TX) U2.44(I/O9)
SDRAM_D10: U1.32(SD_D10/__SRAM_D10__/GPIO99_/I2S_DI_/NAND_ALE_/UART0_RX_/CAN1_RX) U2.45(I/O10)
SDRAM_D11: U1.31(SD_D11/__SRAM_D11__/GPIO100_/I2S_LRCK_/NAND_WR#_/UART0_TX_/CAN1_TX) U2.47(I/O11)
SDRAM_D12: U1.30(SD_D12/__SRAM_D13/_GPIO101_/UART1_RX_/NAND_RDY_/I2C_SDA1_/PWM0) U2.48(I/O12)
SDRAM_D13: U1.29(SD_D13/__SRAM_D13__/GPIO102_/UART1_TX_/NAND_CE#_/I2C_SCL1_/PWM1) U2.50(I/O13)
SDRAM_D14: U1.28(SD_D14/__SRAM_D14__/GPIO103_/I2C_SDA/_PWM2_/UART2_RX_/MDC) U2.51(I/O14)
SDRAM_D15: U1.27(SD_D15/__SRAM_D15_/GPIO104_/I2C_SCL_/PWM3_/UART2_TX_/MDIO) U2.53(I/O15)
SDRAM_DQM0: U1.36(SD_DQM0/__SRAM_BLEn) U2.15(LDQM)
SDRAM_DQM1: U1.35(SD_DQM1/__SRAM_BHEn__/GPIO96_/I2S_DO_/PWM1_/XTALI_/UART6_RX/__UART0_DCD) U2.39(UDQM)
SPI0_CLK: R7.3 U1.94(SPI_CLK_/GPIO78_/Sdio_clk_/UART5_TX/__UART0_DTR) U6.3(S2A)
SPI0_CS0: U1.92(SPI0_CS0_/GPIO81_/Sdio_Dat1_/SDRAM_CS1_/UART5_RX/__UART0_DSR) U6.13(S2D)
SPI0_MISO: R7.1 U1.90(SPI0_MISO_/GPIO80_/Sdio_Cmd_/UART4_RX/__UART0_CTS) U6.10(S2C)
SPI0_MOSI: R7.2 U1.91(SPI0_MOSI_/GPIO79_/Sdio_Dat0_/UART4_TX/__UART0_RTS) U6.6(S2B)
UART2_RX: P3.15 U1.149(MAC_COL_/GPIO36_/CAMDATA0_/UART2_RX_/LCD_R1_/SPI1_CS0/__Sdio_Dat1) U5.5(ERR#)
UART2_TX: P3.16 U1.150(MAC_RXC_/GPIO37_/PWM3_/UART2_TX_/LCD_R2_/SPI1_CS1/__Sdio_Dat2) U5.6(PEMP)
W_CLK: U3.6(CLK) U6.4(DA)
W_MISO: U3.2(MISO) U6.9(DC)
W_MOSI: U3.5(MOSI) U6.7(DB)
XTALI: C1.2 R2.1 U1.1(XTALI) X1.1
XTALO: C2.2 R2.2 U1.2(XTAL0) X1.3
NetC49_1: C49.1 R30.1 U5.2(RSTI)
NetC54_2: C54.2 U5.14(XO) X3.3
NetC55_2: C55.2 U5.13(XI) X3.1
NetD1_A: D1.A R5.1
NetD2_A: D2.A R38.2
NetL2_1: L2.1 U4.3(LX)
NetL3_1: L3.1 U7.3(LX)
NetR3_2: R3.2 U1.167(USB_REXT)
NetR4_2: R4.2 U1.159(OTG_REXT)
NetR17_2: R17.2 U1.81(ADC_REXT)
NetR31_1: R31.1 R33.2 U4.5(FB)
NetR34_2: R34.2 U4.1(EN)
NetR35_1: R35.1 R36.2 U7.5(FB)
NetR37_2: R37.2 U7.1(EN)

Not connected (* = marked no-connect by the designer): J1 A5(CC1) A8(SBU1) B5(CC2) B8(SBU2); R6 1 8; R7 4 5; S1 1; U2 40(NC); U5 1(ACT#) 3(SIN#) 4(AFD#) 7(ACK#) 8(SLCT) 16(D1) 17(D2) 19(D4) 21(D6) 24(SCL) 25(STB#) 26(INI#)

## Notes on the sheet
- 主频晶振部分
- 时钟晶振部分
- 3V3电源滤波退偶部分
- 调试模式下TDI上拉，复用模式下TDI下拉
- MCU复位部分
- 调试接口部分
- 1V2电源滤波退偶部分
- MCU部分
- I/O接口部分
- 此处A12在换其他芯片时可以用到
- 调试状态下 JTAG_SEL拉低，
- 默认状态下EJTAG_RST拉低
- 复用功能情况下JTAG_SEL拉高
- EJTAG模式上拉；JTAG模式下拉。
- SDRAM部分
- NOR Flash部分
- 调试接口配置部分
- 3V3电源部分
- (near C50) 3.3V/2A
- (near R33) Vfb=0.6V
- 1V2电源部分
- 烧写通讯部分
- 注意：
- 1.S3短接为烧写模式
- 2.S3断开为工作模式
- Type-C 部分
- 烧写工作连接配置部分
- LS1C300B_176A_Msystem
- 1C300B176A04
- V2.1
- 李国辉
- (in symbol TYPE-C-31-M-12) TypeC-16PIN

## Library data of the parts
C1 C2 C54 C55 = 0603 22pF (220) 5% 50V: 贴片电容; ComponentLink1Description: 供应商链接; ComponentLink1URL: http://www.szlcsc.com/product/details_2005.html; Package: 0603; Supplier: LC; SuppliersPartNumber: C1653
C3 C4 = 0603 12pF (120) 5% 50V: 贴片电容; ComponentLink1Description: 供应商链接; ComponentLink1URL: http://www.szlcsc.com/product/details_39506.html; Package: 0603; Supplier: LC; SuppliersPartNumber: C38523
C5-C31 C33-C49 C52 C53 = Cap: Capacitor; Published: 8-Jun-2000; LatestRevisionDate: 17-Jul-2002; LatestRevisionNote: Re-released for DXP Platform.; PackageReference: RAD-0.3; Publisher: Altium Limited; PackageDescription: Radial Cap, Thru-Hole; 2 Leads; 0.3 in Pin Spacing
C32 C50 C51 C56 C57 = 0603 10uF (106) 10% 10V: 贴片电容; ComponentLink1Description: 供应商链接; ComponentLink1URL: http://www.szlcsc.com/product/details_20411.html; Package: 0603; Supplier: LC; SuppliersPartNumber: C19702
D1 = 0603 蓝灯: 发光二极管; ComponentLink1Description: 供应商链接; ComponentLink1URL: http://www.szlcsc.com/product/details_73150.html; Package: 0603; Supplier: LC; SuppliersPartNumber: C72041
D2 = 0603 白灯: 发光二极管; ComponentLink1Description: 供应商链接; ComponentLink1URL: http://www.szlcsc.com/product/details_2663.html; Package: 0603; Supplier: LC; SuppliersPartNumber: C2290
F1 = FU: 贴片保险丝; 版权归属: 源创客; BOM名称: 贴片保险丝; 学习资源: www.ooocke.com
JP1 = Header 7: 7P接插件; 版权归属: 源创客; BOM名称: 7P接插件; 学习资源: www.ooocke.com
L1-L3 = L: 小功率贴片电感; 版权归属: 源创客; BOM名称: 小功率贴片电感; 学习资源: www.ooocke.com
P2 P3 P5 = MHDR2X14: Header, 14-Pin, Dual row; LatestRevisionDate: 17-Jul-2002; LatestRevisionNote: Re-released for DXP Platform.; Publisher: Altium Limited
P4 P6 = MHDR2X7: Header, 7-Pin, Dual row; LatestRevisionDate: 17-Jul-2002; LatestRevisionNote: Re-released for DXP Platform.; Publisher: Altium Limited
R1 R2 = 0603 1MΩ (1004) 1%: 贴片电阻; ComponentLink1Description: 供应商链接; ComponentLink1URL: http://www.szlcsc.com/product/details_23662.html; Package: 0603; Supplier: LC; SuppliersPartNumber: C22935
R3 R4 R9 R10 = Res1: Resistor; Published: 8-Jun-2000; LatestRevisionDate: 17-Jul-2002; LatestRevisionNote: Re-released for DXP Platform.; PackageReference: AXIAL-0.3; Publisher: Altium Limited; PackageDescription: Axial Device, Thru-Hole; 2 Leads; 0.3 in Pin Spacing
R5 R12 R13 R17 R22-R30 R32 R34-R38 = 0603 10KΩ (1002) 1%: 贴片电阻; ComponentLink1Description: 供应商链接; ComponentLink1URL: http://www.szlcsc.com/product/details_26547.html; Package: 0603; Supplier: LC; SuppliersPartNumber: C25804
R6-R8 = R-8P4R: 贴片网络排阻; 版权归属: 源创客; BOM名称: 贴片网络排阻; 学习资源: www.ooocke.com
R11 = 0603 100KΩ (1003) 1%: 贴片电阻; ComponentLink1Description: 供应商链接; ComponentLink1URL: http://www.szlcsc.com/product/details_26546.html; Package: 0603; Supplier: LC; SuppliersPartNumber: C25803
R31 = 0603 30KΩ (3002) 1%: 贴片电阻; ComponentLink1Description: 供应商链接; ComponentLink1URL: http://www.szlcsc.com/product/details_23711.html; Package: 0603; Supplier: LC; SuppliersPartNumber: C22984
R33 = 0603 6.8KΩ (6801) 1%: 贴片电阻; ComponentLink1Description: 供应商链接; ComponentLink1URL: http://www.szlcsc.com/product/details_23939.html; Package: 0603; Supplier: LC; SuppliersPartNumber: C23212
S1 = SSW-1P: 1路波动开关; BOM名称: 波动开关; 版权归属: 源创客; 学习资源: www.ooocke.com
SW1 = TSW 3x6: 3x6轻触开关; 版权归属: 源创客; BOM名称: 3x6轻触开关; 学习资源: www.ooocke.com
U1 = LS1C300B_176A: 龙芯1C300B QFP176A; Value: LS1C300B_176A
U2 = IS42S16400: ISSI 公司SDRAM ， 166, 133, 100 MHz
U3 = W25Q80BV: nor flash W25Q64....华邦
U4 = RT8059: LDO
U5 = CH341A: USB to Print Port / Parallel
U6 = CH440: 四通道单刀双掷模拟开关 ，EN 低电平使能，IN 低电平 1#端导通，高电平2#端导通，DX是公共端
U7 = SY8089A: LDO
VD1 = 1N4148: 高速开关二极管; 版权归属: 源创客; BOM名称: 高速开关二极管; 学习资源: www.ooocke.com
X1 X3 = XTAL-4: 4脚晶振; 版权归属: 源创客; BOM名称: 4脚晶振; 学习资源: www.ooocke.com
X2 = XTAL-2: 2脚晶振; 版权归属: 源创客; BOM名称: 2脚晶振; 学习资源: www.ooocke.com